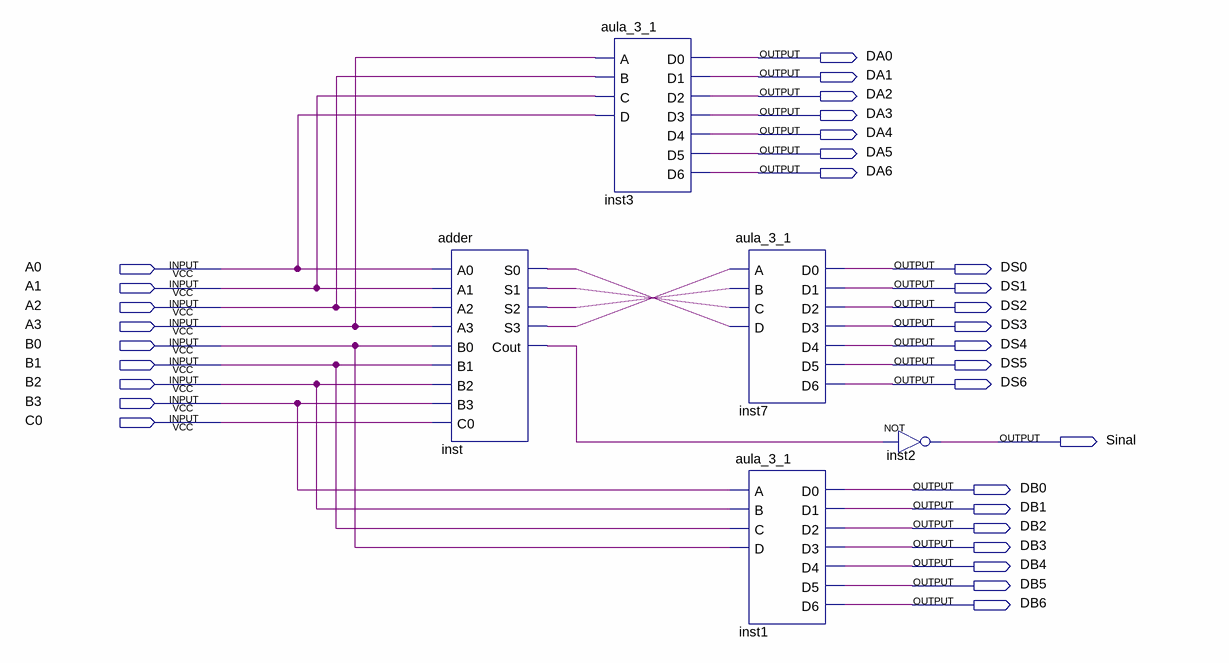
[diagram p0: schematic sheet]
// Quartus schematic somadder.bdf as structural Verilog: 5 symbols, 31 pins
module somadder (
  input  A0,
  input  A1,
  input  A2,
  input  A3,
  input  B0,
  input  B1,
  input  B2,
  input  B3,
  input  C0,
  output DA0,
  output DA1,
  output DA2,
  output DA3,
  output DA4,
  output DA5,
  output DA6,
  output DS0,
  output DS1,
  output DS2,
  output DS3,
  output DS4,
  output DS5,
  output DS6,
  output Sinal,
  output DB0,
  output DB1,
  output DB2,
  output DB3,
  output DB4,
  output DB5,
  output DB6
);

  wire inst_cout, inst_s0, inst_s1, inst_s2, inst_s3;

  adder inst (
    .A0(A0), .A1(A1), .A2(A2), .A3(A3), .B0(B0), .B1(B1), .B2(B2), .B3(B3), .C0(C0), .S0(inst_s0),
    .S1(inst_s1), .S2(inst_s2), .S3(inst_s3), .Cout(inst_cout));
  aula_3_1 inst3 (.A(A3), .B(A2), .C(A1), .D(A0), .D0(DA0), .D1(DA1), .D2(DA2), .D3(DA3), .D4(DA4), .D5(DA5), .D6(DA6));
  aula_3_1 inst7 (
    .A(inst_s3), .B(inst_s2), .C(inst_s1), .D(inst_s0), .D0(DS0), .D1(DS1), .D2(DS2), .D3(DS3), .D4(DS4),
    .D5(DS5), .D6(DS6));
  aula_3_1 inst1 (.A(B3), .B(B2), .C(B1), .D(B0), .D0(DB0), .D1(DB1), .D2(DB2), .D3(DB3), .D4(DB4), .D5(DB5), .D6(DB6));
  not inst2 (Sinal, inst_cout);
endmodule
